# Altium schematic sheet Sheet.schdoc
size 305 x 204 mm
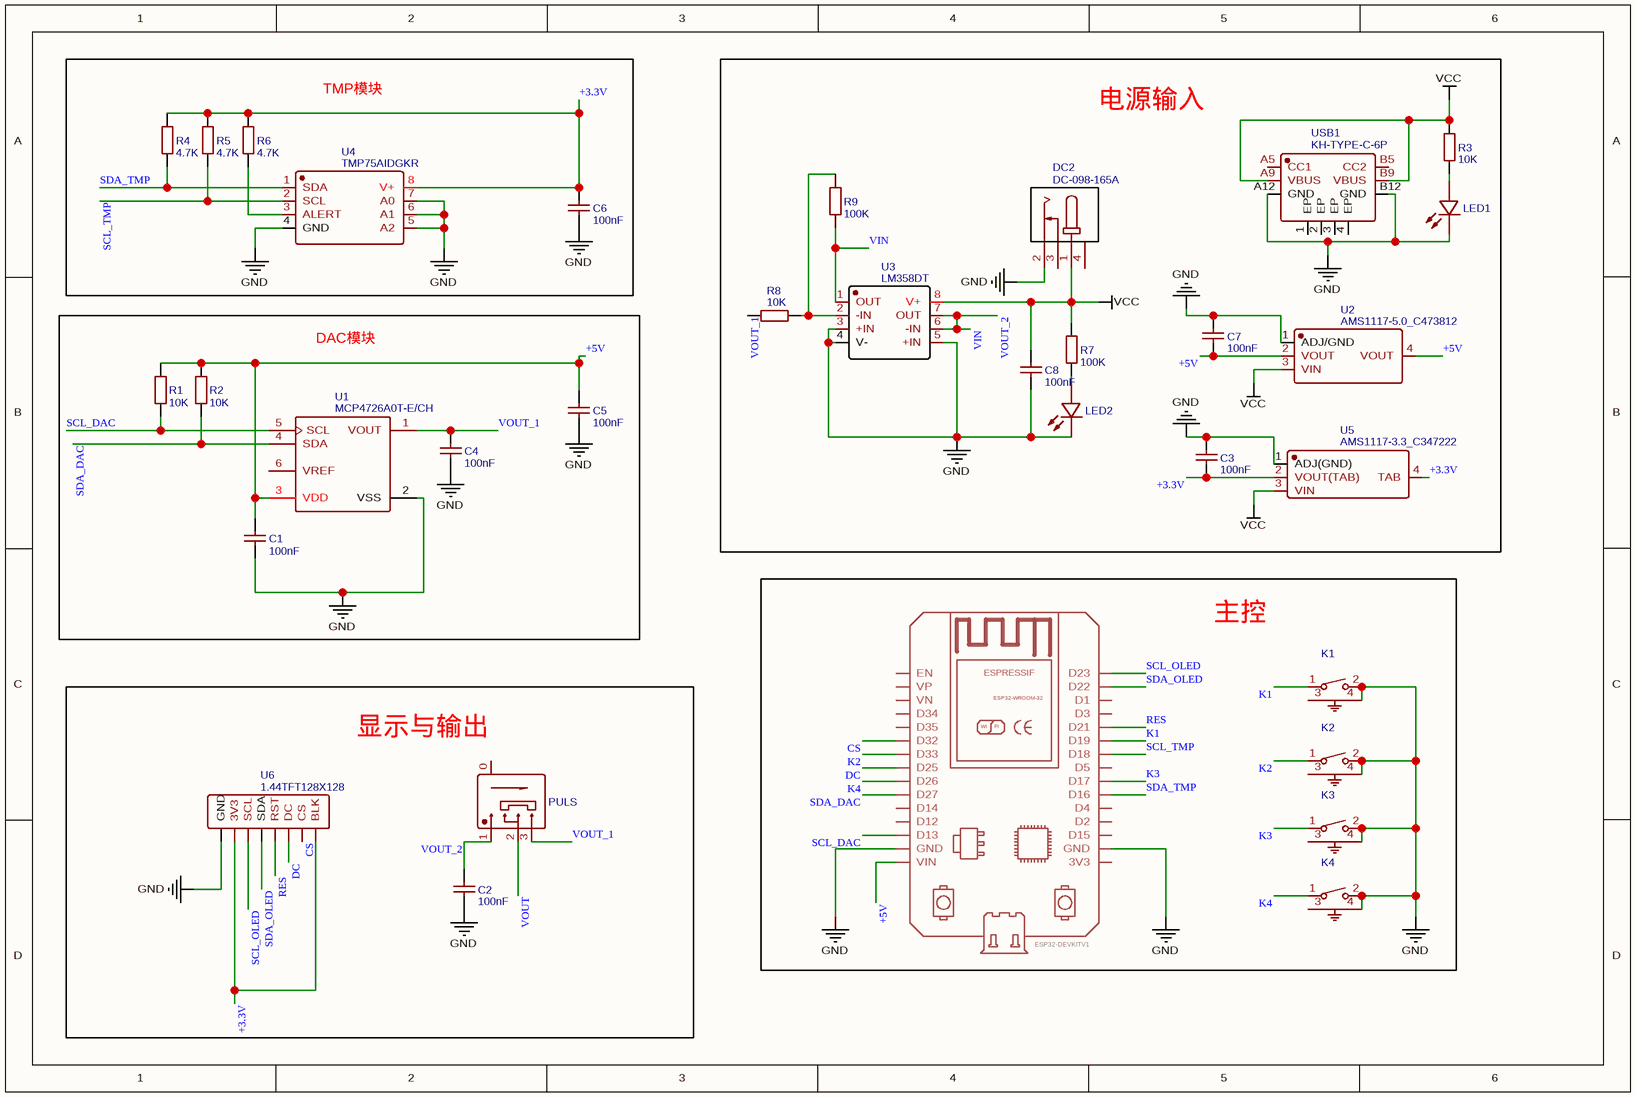
[diagram p0: Sheet.schdoc]

## Parts
BOARD1  ESP32DEVKITV1  [ESP32-DEVKITV1]  (value not drawn)
C1  100nF  [C0402]
C2  100nF  [C0402]
C3  100nF  [C0402]
C4  100nF  [C0402]
C5  100nF  [C0402]
C6  100nF  [C0402]
C7  100nF  [C0402]
C8  100nF  [C0402]
DC2  DC-098-165A  [DC-IN-TH_DC-098-165A]
K1  KH-3635-CAJ  [SW-SMD_KH-3635-CAJ]  (value not drawn)
K2  KH-3635-CAJ  [SW-SMD_KH-3635-CAJ]  (value not drawn)
K3  KH-3635-CAJ  [SW-SMD_KH-3635-CAJ]  (value not drawn)
K4  KH-3635-CAJ  [SW-SMD_KH-3635-CAJ]  (value not drawn)
LED1  17-21SYGC/S530-E3/TR8  [LED0805-RD]  (value not drawn)
LED2  17-21SURC/S530-A2/TR8  [LED0805-RD]  (value not drawn)
PULS  SK-3296S-01-L1  [SW-SMD_3P-P1.50_L2.7-W6.6]  (value not drawn)
R1  10K  [R0402]
R2  10K  [R0402]
R3  10K  [R0603]
R4  4.7K  [R0402]
R5  4.7K  [R0402]
R6  4.7K  [R0402]
R7  100K  [R0603]
R8  10K  [R0603]
R9  100K  [R0603]
U1  MCP4726A0T-E/CH  [SOT-23-6_L2.9-W1.6-P0.95-LS2.8-BL]
U2  AMS1117-5.0_C473812  [SOT-223-3_L6.5-W3.4-P2.30-LS7.0-BR]
U3  LM358DT  [SOIC-8_L5.0-W4.0-P1.27-LS6.0-BL]
U4  TMP75AIDGKR  [VSSOP-8_L3.0-W3.0-P0.65-LS5.0-BL]
U5  AMS1117-3.3_C347222  [SOT-223_L6.7-W3.5-P2.30-BR]
U6  1.44TFT128X128  [1.44TFT128X128]
USB1  KH-TYPE-C-6P  [TYPE-C-SMD_TYPE-C-31-M-16]

## Blocks framed on the sheet
TMP模块: C6 R4-R6 U4
电源输入: C3 C7 C8 DC2 LED1 LED2 R3 R7-R9 U2 U3 U5 USB1
DAC模块: C1 C4 C5 R1 R2 U1
主控: BOARD1 K1-K4
显示与输出: C2 PULS U6

## Nets
GND: BOARD1.GND BOARD1.GND@1(GND) C1.2 C2.1 C3.2 C4.1 C5.1 C6.1 C7.2 C8.1 DC2.2 K1.2(D) K1.4(B) K2.2(D) K2.4(B) K3.2(D) K3.4(B) K4.2(D) K4.4(B) LED1.1(K) LED2.1(K) U1.2(VSS) U2.1(ADJ/GND) U3.3(+IN) U3.4(V-) U3.5(+IN) U4.4(GND) U4.5(A2) U4.6(A1) U4.7(A0) U5.1(ADJ(GND)) U6.1(GND) USB1.A12(GND) USB1.B12(GND)
VCC: C8.2 DC2.1 R3.2 R7.2 U2.3(VIN) U3.8(V+) U5.3(VIN) USB1.A9(VBUS) USB1.B9(VBUS)
+3.3V: C3.1 C6.2 R4.2 R5.2 R6.2 U4.8(V+) U5.2(VOUT(TAB)) U5.4(TAB) U6.2(3V3) U6.8(BLK)
+5V: BOARD1.VIN C1.1 C5.2 C7.1 R1.1 R2.2 U1.3(VDD) U2.2(VOUT) U2.4(VOUT)
CS: BOARD1.D32 U6.7(CS)
DC: BOARD1.D25 U6.6(DC)
K1: BOARD1.D19 K1.1(C)
K2: BOARD1.D33 K2.1(C)
K3: BOARD1.D17 K3.1(C)
K4: BOARD1.D26 K4.1(C)
RES: BOARD1.D21 U6.5(RST)
SCL_DAC: BOARD1.D13 R1.2 U1.5(SCL)
SCL_OLED: BOARD1.D23 U6.3(SCL)
SCL_TMP: BOARD1.D18 R5.1 U4.2(SCL)
SDA_DAC: BOARD1.D27 R2.1 U1.4(SDA)
SDA_OLED: BOARD1.D22 U6.4(SDA)
SDA_TMP: BOARD1.D16 R4.1 U4.1(SDA)
VIN: C2.2 PULS.1 R9.1 U3.1(OUT) U3.6(-IN) U3.7(OUT)  [also labelled VOUT_2]
VOUT: PULS.2
VOUT_1: C4.2 PULS.3 R8.2 U1.1(VOUT)
NetLED1_2: LED1.2(A) R3.1
NetLED2_2: LED2.2(A) R7.1
NetR6_1: R6.1 U4.3(ALERT)
NetR8_1: R8.1 R9.2 U3.2(-IN)

Not connected (* = marked no-connect by the designer): BOARD1 3V3 D1 D2 D3 D4 D5 D12 D14 D15 D34 D35 EN VN VP; DC2 3 4; K1 3(A); K2 3(A); K3 3(A); K4 3(A); PULS 0; U1 6(VREF); USB1 1(EP) 2(EP) 3(EP) 4(EP) A5(CC1) B5(CC2)

## Notes on the sheet
- (in symbol ESP32DEVKITV1) ESPRESSIF; ESP32-WROOM-32; WI; FI; ESP32-DEVKITV1

## Library data of the parts
BOARD1 = ESP32DEVKITV1: Contributor: radio; Package Display: No; spicePre: B; spiceSymbolName: ESP32DEVKITV1
C1-C8 = 100nF: BOM_Manufacturer: Prosperity Dielectrics; BOM_Manufacturer Part: FN15X104K160PNG; nameAlias: Capacitance; Contributor: LCSC; BOM_Supplier: LCSC; BOM_Supplier Part: C328914; spicePre: C; spiceSymbolName: FN15X104K160PNG
DC2 = DC-098-165A: BOM_Manufacturer: Rectangular Connectors - Contacts; Contributor: LCSC; BOM_Supplier: LCSC; BOM_Supplier Part: C129001; BOM_Manufacturer Part: DC-098-165A; spicePre: D; spiceSymbolName: DC-098-165A
K1-K4 = KH-3635-CAJ: BOM_Manufacturer: Shenzhen Kinghelm Elec; Contributor: LCSC; BOM_Paste Type: expand; BOM_Supplier: LCSC; BOM_Supplier Part: C530670; BOM_Manufacturer Part: KH-3635-CAJ; spicePre: S; spiceSymbolName: KH-3635-CAJ
LED1 = 17-21SYGC/S530-E3/TR8: BOM_Manufacturer: EVERLIGHT; Contributor: LCSC; BOM_Paste Type: recommend; BOM_Supplier: LCSC; BOM_Manufacturer Part: 17-21SYGC/S530-E3/TR8; BOM_Supplier Part: C142303; spicePre: L; spiceSymbolName: 17-21SYGC/S530-E3/TR8
LED2 = 17-21SURC/S530-A2/TR8: BOM_Manufacturer: EVERLIGHT; Contributor: LCSC; BOM_Paste Type: recommend; BOM_Supplier: LCSC; BOM_Manufacturer Part: 17-21SURC/S530-A2/TR8; BOM_Supplier Part: C131244; spicePre: L; spiceSymbolName: 17-21SURC/S530-A2/TR8
PULS = SK-3296S-01-L1: BOM_Manufacturer: XKB Enterprise; Contributor: LCSC; BOM_Supplier: LCSC; BOM_Supplier Part: C319020; BOM_Manufacturer Part: SK-3296S-01-L1; spicePre: S; spiceSymbolName: SK-3296S-01-L1
R1 R2 = 10K: BOM_Manufacturer: UniOhm; BOM_Manufacturer Part: 0402WGJ0472TCE; nameAlias: Resistance (Ohms); BOM_Paste Type: expand; BOM_Supplier: LCSC; BOM_Supplier Part: C25940; spicePre: R; spiceSymbolName: 0402WGJ0472TCE
R3 R8 = 10K: BOM_Manufacturer: UniOhm; BOM_Manufacturer Part: 0603WAF1002T5E; nameAlias: Resistance (Ohms); BOM_Paste Type: base; BOM_Supplier: LCSC; BOM_Supplier Part: C25804; spicePre: R; spiceSymbolName: 0603WAF1002T5E
R4-R6 = 4.7K: BOM_Manufacturer: UniOhm; BOM_Manufacturer Part: 0402WGJ0472TCE; nameAlias: Resistance (Ohms); BOM_Paste Type: expand; BOM_Supplier: LCSC; BOM_Supplier Part: C25940; spicePre: R; spiceSymbolName: 0402WGJ0472TCE
R7 R9 = 100K: BOM_Manufacturer: UniOhm; BOM_Manufacturer Part: 0603WAJ0104T5E; nameAlias: Resistance (Ohms); BOM_Paste Type: expand; BOM_Supplier: LCSC; BOM_Supplier Part: C15458; spicePre: R; spiceSymbolName: 0603WAJ0104T5E
U1 = MCP4726A0T-E/CH: BOM_Manufacturer: Microchip Tech; Contributor: LCSC; BOM_Paste Type: expand; BOM_Supplier: LCSC; BOM_Supplier Part: C191581; BOM_Manufacturer Part: MCP4726A0T-E/CH; spicePre: U; spiceSymbolName: MCP4726A0T-E/CH
U2 = AMS1117-5.0_C473812: BOM_Manufacturer: Slkor(SLKORMICRO Elec.); Contributor: LCSC; BOM_Supplier: LCSC; BOM_Supplier Part: C473812; BOM_Manufacturer Part: AMS1117-5.0; spicePre: U; spiceSymbolName: AMS1117-5.0_C473812
U3 = LM358DT: BOM_Manufacturer: STMicroelectronics; BOM_Paste Type: expand; BOM_Supplier: LCSC; BOM_Manufacturer Part: LM358DT; image: //image.lceda.cn/szlcsc/C9418.jpg; BOM_Supplier Part: C9418; spicePre: U; spiceSymbolName: LM358DT
U4 = TMP75AIDGKR: BOM_Manufacturer: TI; Contributor: LCSC; BOM_Paste Type: expand; BOM_Supplier: LCSC; BOM_Manufacturer Part: TMP75AIDGKR; BOM_Supplier Part: C105258; spicePre: U; spiceSymbolName: TMP75AIDGKR
U5 = AMS1117-3.3_C347222: BOM_Manufacturer: Youtai Semiconductor Co., Ltd.; Contributor: LCSC; BOM_Paste Type: expand; BOM_Supplier: LCSC; BOM_Supplier Part: C347222; BOM_Manufacturer Part: AMS1117-3.3; spicePre: U; spiceSymbolName: AMS1117-3.3_C347222
U6 = 1.44TFT128X128: Contributor: IoT-J; spicePre: U; spiceSymbolName: 1.44TFT128X128
USB1 = KH-TYPE-C-6P: BOM_Manufacturer: Shenzhen Kinghelm Elec; Contributor: LCSC; BOM_Paste Type: expand; BOM_Supplier: LCSC; BOM_Supplier Part: C709355; BOM_Manufacturer Part: KH-TYPE-C-6P; spicePre: U; spiceSymbolName: KH-TYPE-C-6P